# EasyEDA schematic Proyek6_Joy.json
TITLE: Sheet_1; REV: 1.0; Date: 2021-11-16; Sheet: 1/1; Drawn By: Joy Milliaan; Company: Your Company
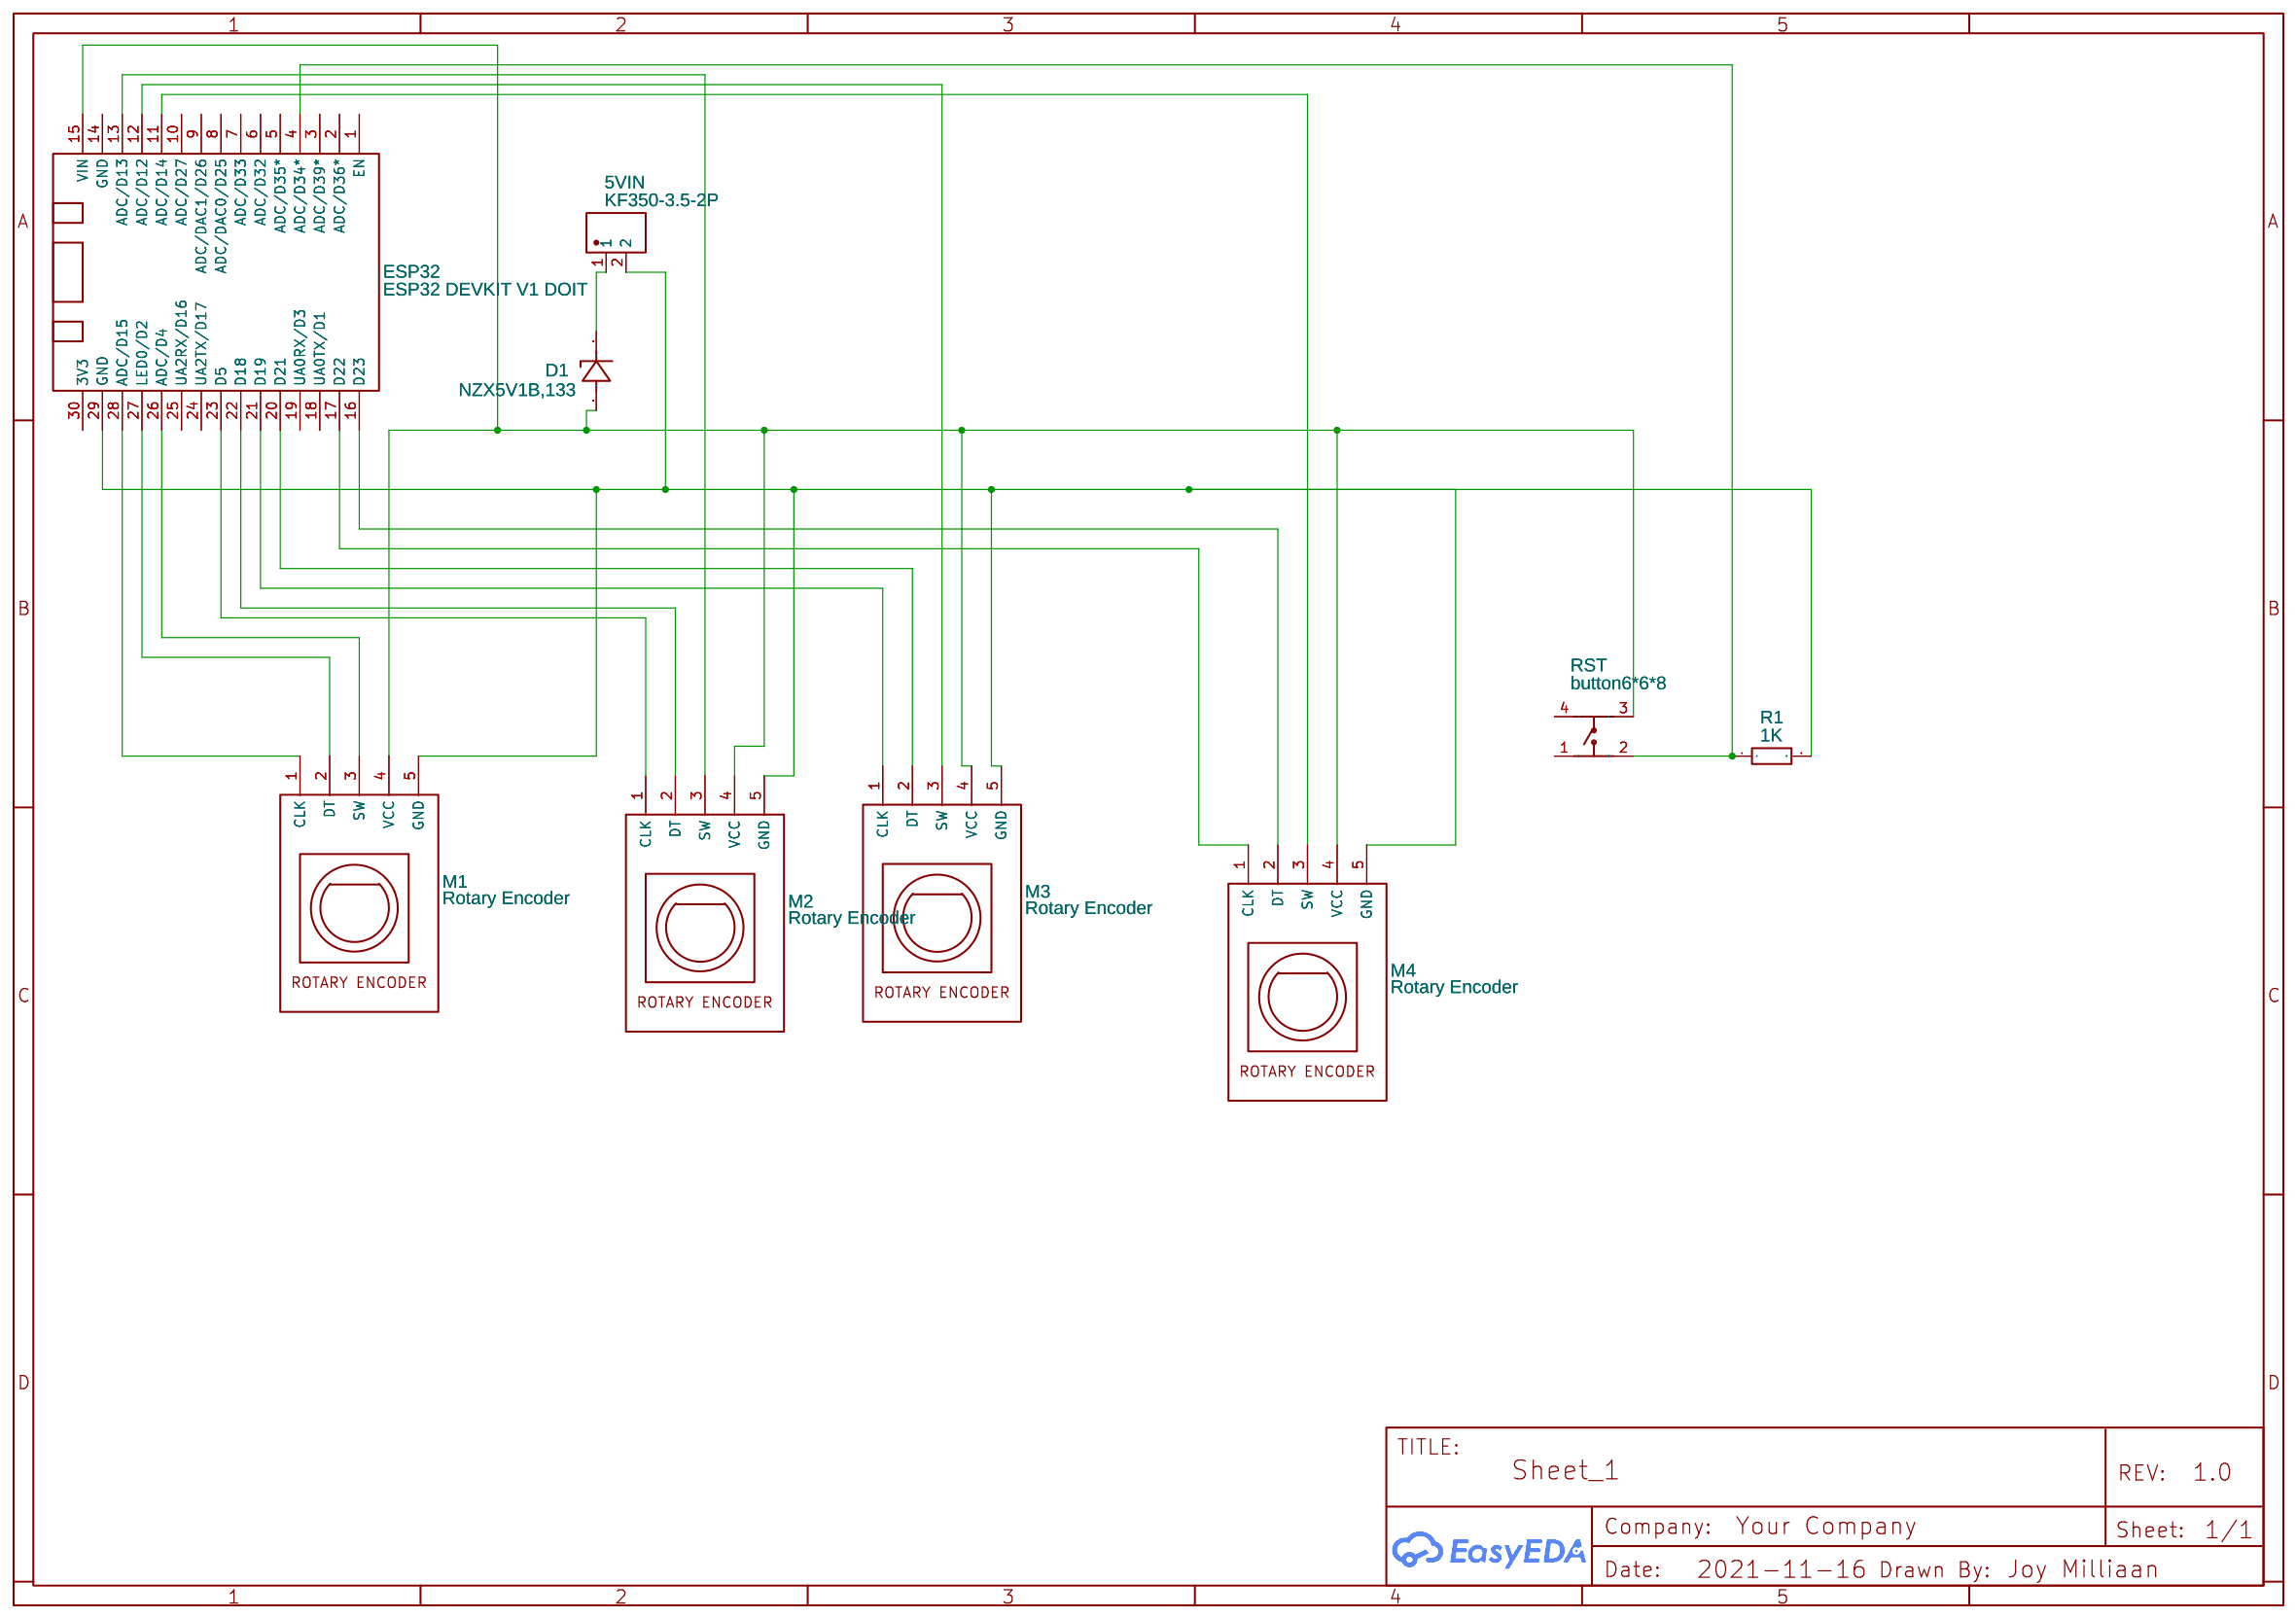
[diagram p0: schematic sheet]

## Parts
5VIN  KF350-3.5-2P  [CONN-TH_P3.50_KF350-3.5-2P]
D1  NZX5V1B,133  [SOD-27_BD1.9-L4.3-P8.25-D0.6-RD]
ESP32  ESP32 DEVKIT V1 DOIT  [DOIT-ESP32-DEVKIT-V1]
M1  Rotary Encoder  [KY-040]
M2  Rotary Encoder  [KY-040]
M3  Rotary Encoder  [KY-040]
M4  Rotary Encoder  [KY-040]
R1  1K  [RES-TH_BD2.2-L6.5-P10.50-D0.6]
RST  button6*6*8  [KEY-TH_4P-L6.0-W6.0-P4.50-LS7.5]

## Library data of the parts
5VIN = KF350-3.5-2P: Supplier: LCSC; Supplier Part: C474892; Manufacturer: Cixi Kefa Elec; Contributor: LCSC; JLCPCB Part Class: Extended Part
D1 = NZX5V1B,133: Supplier: LCSC; Supplier Part: C551729; Manufacturer: Nexperia; Contributor: LCSC; JLCPCB Part Class: Extended Part
ESP32 = ESP32 DEVKIT V1 DOIT: Contributor: ConceitoTeam
M1-M4 = Rotary Encoder: Contributor: carlo78
R1 = CFR0W4J0102A50: Supplier: LCSC; Manufacturer: UniOhm; Supplier Part: C61293; JLCPCB Part Class: Extended Part
RST = button6*6*8: Supplier Part: C59982; Supplier: LCSC; Manufacturer: ReliaPro

## Nets
Net-(5VIN-1): 5VIN.1 D1.1(C)
Net-(5VIN-2): 5VIN.2 ESP32.29(GND) M1.5(GND) M2.5(GND) M3.5(GND) M4.5(GND) R1.2
Net-(D1-2): D1.2(A) ESP32.15(VIN) M1.4(VCC) M2.4(VCC) M3.4(VCC) M4.4(VCC) RST.3
Net-(ESP32-4): ESP32.4(ADC/D34*) R1.1 RST.2
Net-(ESP32-11): ESP32.11(ADC/D14) M4.3(SW)
Net-(ESP32-12): ESP32.12(ADC/D12) M3.3(SW)
Net-(ESP32-13): ESP32.13(ADC/D13) M2.3(SW)
Net-(ESP32-16): ESP32.16(D23) M4.2(DT)
Net-(ESP32-17): ESP32.17(D22) M4.1(CLK)
Net-(ESP32-20): ESP32.20(D21) M3.2(DT)
Net-(ESP32-21): ESP32.21(D19) M3.1(CLK)
Net-(ESP32-22): ESP32.22(D18) M2.2(DT)
Net-(ESP32-23): ESP32.23(D5) M2.1(CLK)
Net-(ESP32-26): ESP32.26(ADC/D4) M1.3(SW)
Net-(ESP32-27): ESP32.27(LED0/D2) M1.2(DT)
Net-(ESP32-28): ESP32.28(ADC/D15) M1.1(CLK)

Not connected (* = marked no-connect by the designer): ESP32 1(EN) 2(ADC/D36*) 3(ADC/D39*) 5(ADC/D35*) 6(ADC/D32) 7(ADC/D33) 8(ADC/DAC0/D25) 9(ADC/DAC1/D26) 10(ADC/D27) 14(GND) 18(UA0TX/D1) 19(UA0RX/D3) 24(UA2TX/D17) 25(UA2RX/D16) 30(3V3); RST 1 4
